# EAGLE schematic balanceador (EAGLE 7.6.0)
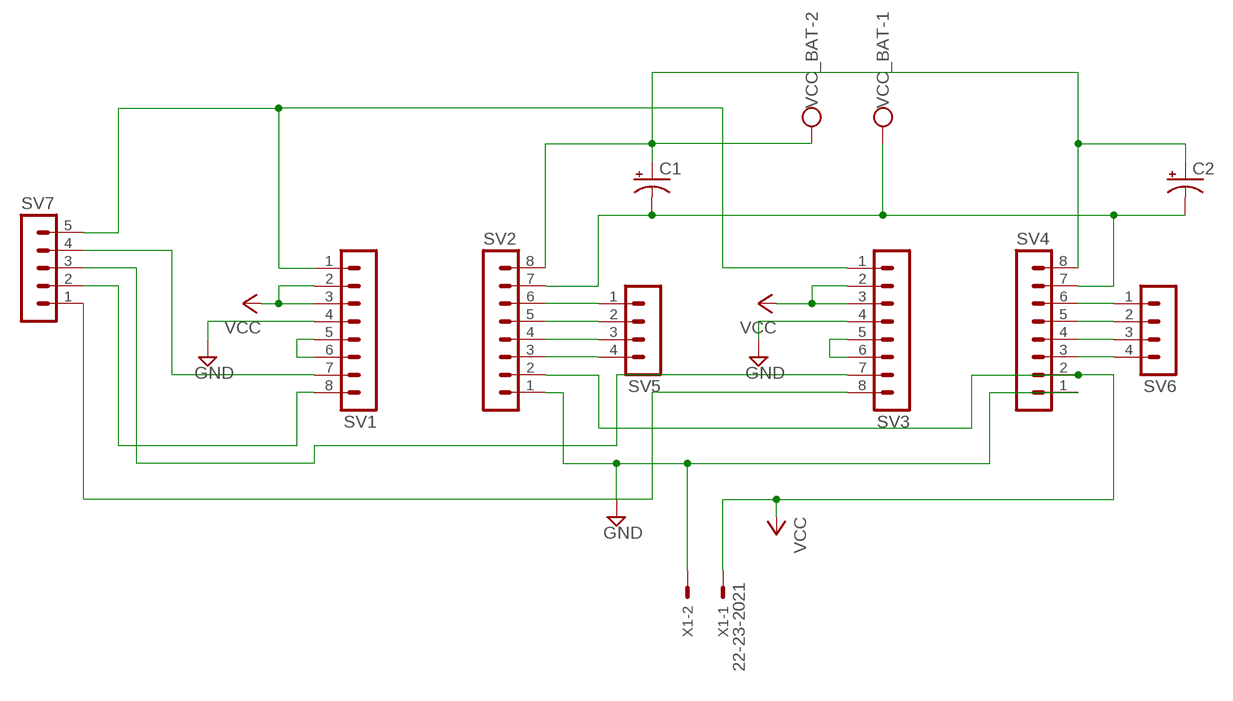
[diagram p0: schematic, sheet 1]

## Parts
C1  CPOL-USE2.5-6  [E2,5-6]
C2  CPOL-USE2.5-6  [E2,5-6]
SV1  MA08-1  [MA08-1]
SV2  MA08-1  [MA08-1]
SV3  MA08-1  [MA08-1]
SV4  MA08-1  [MA08-1]
SV5  MA04-1  [MA04-1]
SV6  MA04-1  [MA04-1]
SV7  MA05-1  [MA05-1]
VCC_BAT  W237-102  [W237-102]
X1  22-23-2021  [22-23-2021]

## Nets
GND: SV1.4 SV2.1 SV3.4 SV4.1 X1.2
N$1: SV2.6 SV5.1
N$2: SV2.5 SV5.2
N$3: SV2.4 SV5.3
N$4: SV2.3 SV5.4
N$5: SV4.6 SV6.1
N$6: SV4.5 SV6.2
N$7: SV4.4 SV6.3
N$8: SV4.3 SV6.4
N$9: SV3.5 SV3.6
N$10: C1.+ C2.+ SV2.8 SV4.8 VCC_BAT.2
N$11: SV1.5 SV1.6
N$12: C1.- C2.- SV2.7 SV4.7 VCC_BAT.1
N$13: SV1.8 SV7.2
N$14: SV1.1 SV3.1 SV7.5
N$15: SV3.8 SV7.1
N$16: SV1.7 SV7.4
N$17: SV3.7 SV7.3
VCC: SV1.2 SV1.3 SV2.2 SV3.2 SV3.3 SV4.2 X1.1

## Library data of the parts
C1 C2 = rcl:CPOL-US: POLARIZED CAPACITOR, American symbol
SV1-SV4 = con-lstb:MA08-1: PIN HEADER; OC_FARNELL: unknown; OC_NEWARK: unknown
SV5 SV6 = con-lstb:MA04-1: PIN HEADER; OC_FARNELL: unknown; OC_NEWARK: unknown
SV7 = con-lstb:MA05-1: PIN HEADER; OC_FARNELL: unknown; OC_NEWARK: unknown
VCC_BAT = con-wago-500:W237-102: WAGO SCREW CLAMP; MPN: 237-102; OC_FARNELL: unknown; OC_NEWARK: 70K9898
X1 = con-molex:22-23-2021: .100" (2.54mm) Center Header - 2 Pin; MF: MOLEX; MPN: 22-23-2021; OC_FARNELL: 1462926; OC_NEWARK: 25C3832